# Altium schematic sheet Analog Input.SchDoc
size A; SheetNumber: 7; SheetTotal: 15
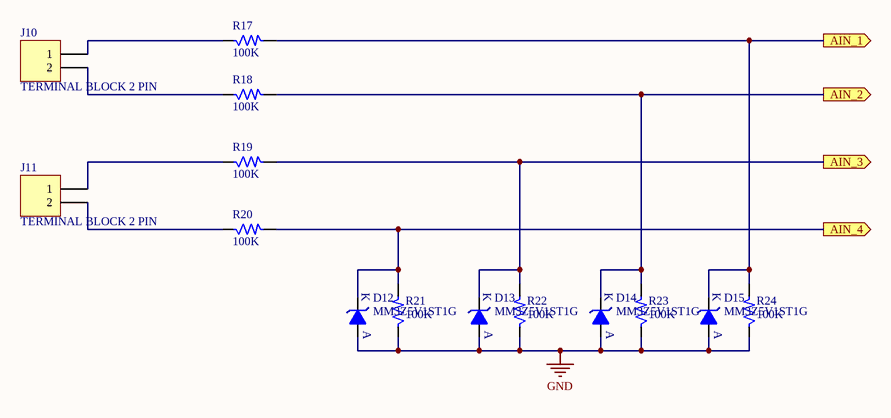
[diagram p0: Analog Input.SchDoc]

## Parts
D12  MM3Z5V1ST1G  [DIO_SOD-323F]
D13  MM3Z5V1ST1G  [DIO_SOD-323F]
D14  MM3Z5V1ST1G  [DIO_SOD-323F]
D15  MM3Z5V1ST1G  [DIO_SOD-323F]
J10  TERMINAL BLOCK 2 PIN  [CON2_P196_1729128_TH_ST]
J11  TERMINAL BLOCK 2 PIN  [CON2_P196_1729128_TH_ST]
R17  100K  [RES_0805]
R18  100K  [RES_0805]
R19  100K  [RES_0805]
R20  100K  [RES_0805]
R21  100K  [RES_0805]
R22  100K  [RES_0805]
R23  100K  [RES_0805]
R24  100K  [RES_0805]

## Ports
AIN_1 (out), AIN_2 (out), AIN_3 (out), AIN_4 (out)

## Nets
GND: D12.A D13.A D14.A D15.A R21.1 R22.1 R23.1 R24.1
AIN_1: D15.K R17.2 R24.2 ; port AIN_1
AIN_2: D14.K R18.2 R23.2 ; port AIN_2
AIN_3: D13.K R19.2 R22.2 ; port AIN_3
AIN_4: D12.K R20.2 R21.2 ; port AIN_4
NetJ10_1: J10.1 R17.1
NetJ10_2: J10.2 R18.1
NetJ11_1: J11.1 R19.1
NetJ11_2: J11.2 R20.1

## Library data of the parts
D12-D15 = DIO-Z_5.1V-300mW-SOD323: Zener Diode 5.1V 300mW ±2% Surface Mount SOD-323; Manufacturer: Vishay Semiconductors; Alternate Part Number-1: NA; Manufacturer Part Number: MM3Z5V1ST1G; Case/Package: SOD323; Supplier-1: SIRICOM; Supplier Part Number-1: BZT52C5V1S
J10 J11 = CON-TB_2X1-196-ST-TH: 2 Pins, 1 Row 5mm Pitch, straight Connector, male; Manufacturer: Phoenix Contact; Manufacturer Part Number: MKDSN1,5/2; Alternate Part Number-1: NA; Case/Package: TH-CON; Supplier-1: SP ROAD; Supplier Part Number-1: MKDSN1,5/2
R17-R24 = RES_100K-0.125W-1%-0805: 100 kOhms ±1% 0.125W, 1/8W Chip Resistor 0805 (2012 Metric) Automotive AEC-Q200 Thick Film; Manufacturer: Walsin; Manufacturer Part Number: WR08X1003FTL; Alternate Part Number-1: NA; Case/Package: 0805; Supplier-1: SIRICOM; Supplier Part Number-1: WR08X1003FTL